# EAGLE design Ex 16 extra gpio 74HC595 (EAGLE 7.6.0)
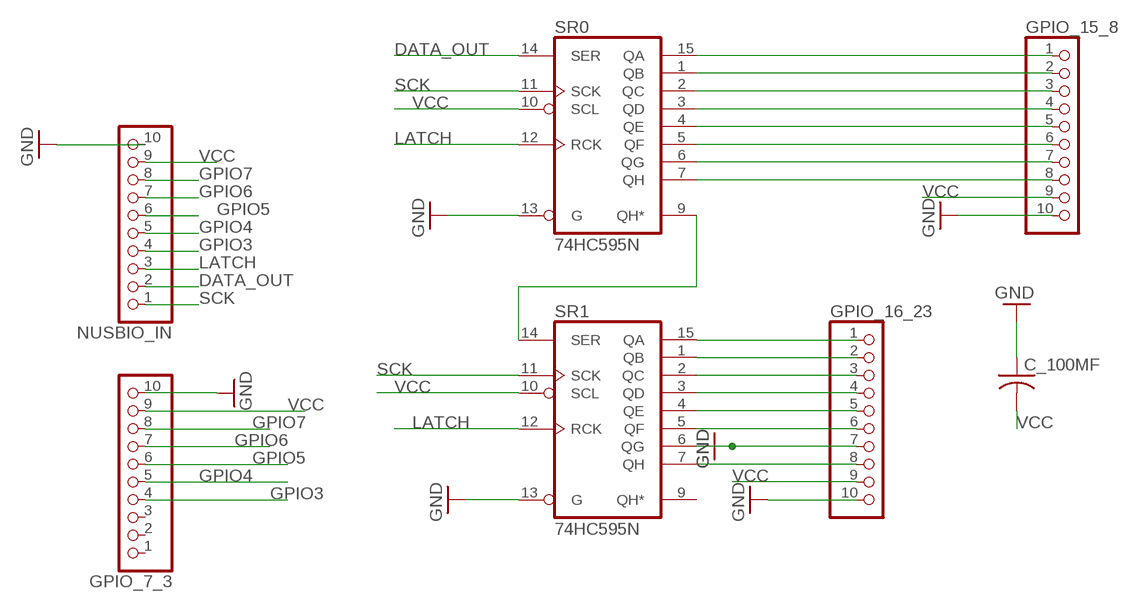
[diagram p0: schematic, sheet 1]

## Parts
C_100MF  C-US025-030X050  [C025-030X050]
GPIO_7_3  PINHD-1X10  [1X10-BIG]
GPIO_15_8  PINHD-1X10  [1X10-BIG]
GPIO_16_23  PINHD-1X10  [1X10-BIG]
NUSBIO_IN  PINHD-1X10  [1X10-BIG]
SR0  74HC595N  [DIL16]
SR1  74HC595N  [DIL16]

## Nets
DATA_OUT: NUSBIO_IN.2 SR0.14(SER)
GND: C_100MF.1 GPIO_7_3.10 GPIO_15_8.10 GPIO_16_23.10 NUSBIO_IN.10 SR0.13(G) SR1.13(G)
GPIO3: GPIO_7_3.4 NUSBIO_IN.4
GPIO4: GPIO_7_3.5 NUSBIO_IN.5
GPIO5: GPIO_7_3.6 NUSBIO_IN.6
GPIO6: GPIO_7_3.7 NUSBIO_IN.7
GPIO7: GPIO_7_3.8 NUSBIO_IN.8
LATCH: NUSBIO_IN.3 SR0.12(RCK) SR1.12(RCK)
N$1: GPIO_15_8.1 SR0.15(QA)
N$2: GPIO_15_8.2 SR0.1(QB)
N$3: GPIO_15_8.3 SR0.2(QC)
N$4: GPIO_15_8.4 SR0.3(QD)
N$5: GPIO_15_8.5 SR0.4(QE)
N$6: GPIO_15_8.6 SR0.5(QF)
N$7: GPIO_15_8.7 SR0.6(QG)
N$8: GPIO_15_8.8 SR0.7(QH)
N$9: SR0.9(QH*) SR1.14(SER)
N$10: GPIO_16_23.1 SR1.15(QA)
N$11: GPIO_16_23.2 SR1.1(QB)
N$12: GPIO_16_23.3 SR1.2(QC)
N$13: GPIO_16_23.4 SR1.3(QD)
N$14: GPIO_16_23.5 SR1.4(QE)
N$15: GPIO_16_23.6 SR1.5(QF)
N$16: GPIO_16_23.7 SR1.6(QG) ; supply symbol labelled GND
N$17: GPIO_16_23.8 SR1.7(QH)
SCK: NUSBIO_IN.1 SR0.11(SCK) SR1.11(SCK)
VCC: C_100MF.2 GPIO_7_3.9 GPIO_15_8.9 GPIO_16_23.9 NUSBIO_IN.9 SR0.10(SCL) SR1.10(SCL)
Unconnected: GPIO_7_3.1 GPIO_7_3.2 GPIO_7_3.3 SR1.9(QH*)

## Power pins joined to a net without a drawn wire
GND: SR0.8(GND) SR1.8(GND)
VCC: SR0.16(VCC) SR1.16(VCC)

## Library data of the parts
C_100MF = adafruit:C-US: CAPACITOR, American symbol
GPIO_7_3 GPIO_15_8 GPIO_16_23 NUSBIO_IN = adafruit:PINHD-1X10: Pin header 1x10 0.1" spacing With round pins
SR0 SR1 = 74xx-eu:74*595: 8-bit SHIFT REGISTER, output latch

## Board
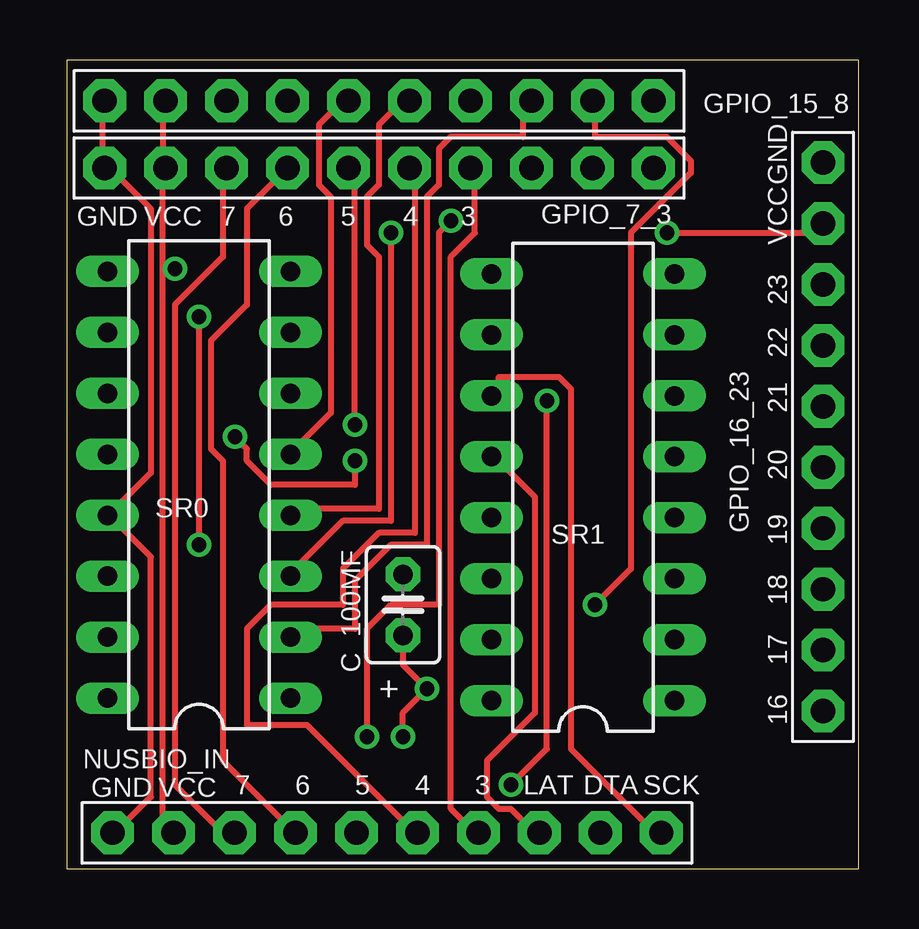
[diagram p1: board, top side]
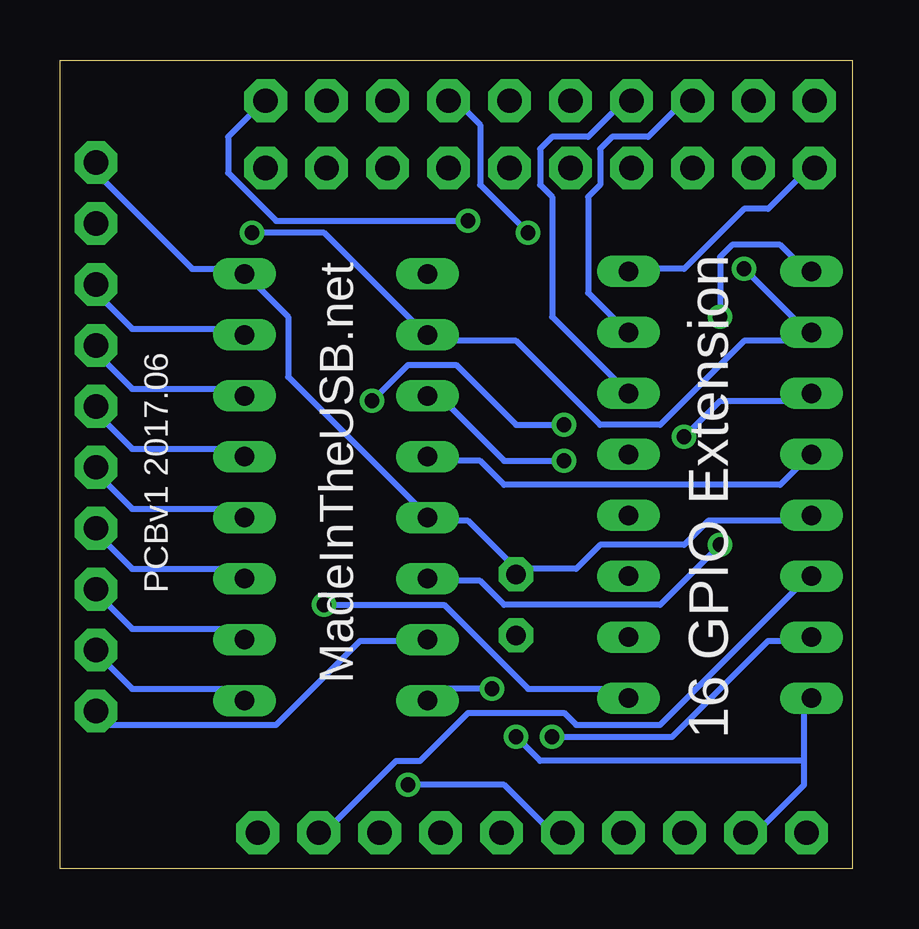
[diagram p2: board, bottom side, seen from below]

Size 33 x 33.7 mm. Coordinates in mm from the lower left corner, seen from the top.
Outline: 0,0 33,0 33,33.7 0,33.7 0,0
Copper layers (1*16): Top 0.035mm / dielectric 1.5mm / Bottom 0.035mm
Design rules "default": minimum track width 10mil, minimum drill 24mil, track to track 8mil, track to pad 8mil, pad to pad 8mil, via to via 8mil, smd to smd 8mil, copper to edge 40mil, drill to drill 8mil, minimum pad ring 10mil, minimum via ring 8mil, stop-mask expansion 4mil, vias tented up to drill 0mil, thermal gap 10mil

### Footprints (pad centres in the part's own frame; a part is rotated, then mirrored left to right if it is on the bottom)
C025-030X050 = drill 0.813 pad 1.422 octagon: 1 -1.27,0; 2 1.27,0
1X10-BIG = drill 1.016 pad 1.778 octagon: 1 -11.43,0; 2 -8.89,0; 3 -6.35,0; 4 -3.81,0; 5 -1.27,0; 6 1.27,0; 7 3.81,0; 8 6.35,0; 9 8.89,0; 10 11.43,0
DIL16 = drill 0.813 long: 1 -8.89,-3.81; 2 -6.35,-3.81; 3 -3.81,-3.81; 4 -1.27,-3.81; 5 1.27,-3.81; 6 3.81,-3.81; 7 6.35,-3.81; 8 8.89,-3.81; 9 8.89,3.81; 10 6.35,3.81; 11 3.81,3.81; 12 1.27,3.81; 13 -1.27,3.81; 14 -3.81,3.81; 15 -6.35,3.81; 16 -8.89,3.81

### Placement (x,y rotation side)
C_100MF  14,11 270 top
GPIO_7_3  13,29.2 180 top
GPIO_15_8  13,32 180 top
GPIO_16_23  31.5,18 90 top
NUSBIO_IN  13.33,1.5 180 top
SR0  5.5,16 90 top
SR1  21.5,15.9 90 top

### Tracks (layer width: path | path; a pad name or v marks a point on that pad's centre or on a via)
DATA_OUT
  Bottom 0.254: SR0.14 2,12 8,6 11.5,6 12,6.5 16,6.5 18,4.5 19,4.5 22,1.5 NUSBIO_IN.2
GND
  Top 0.254: NUSBIO_IN.10 2,1.5 3.5,3 3.5,13 2,14.5 SR0.13 2,15 3.5,16.5 3.5,27.5 2,29 GPIO_7_3.10 1.5,29.5 1.5,32 GPIO_15_8.10
  Bottom 0.254: 14,12.5 16,14.5 17.5,14.5 SR1.13 18,15 23.5,20.5 23.5,23 25,24.5 SR1.8 25.5,25 27.5,25 31.5,29 GPIO_16_23.10 | SR0.8 9,25 7,25 4.5,27.5 3.5,27.5 2,29 GPIO_7_3.10 | 14,12.5 11.5,12.5 10.5,13.5 7,13.5 6,14.5 2,14.5 SR0.13 | 14,12.5 C_100MF.1
GPIO3
  Top 0.254: GPIO_7_3.4 17,29 17,26.5 16,25.5 16,2.5 17,1.5 NUSBIO_IN.4
GPIO4
  Top 0.254: NUSBIO_IN.5 14.5,1.5 10,6 7.5,6 7.5,10 8.5,11 11.5,11 11.5,12.5 13,14 14.5,14 14.5,29 GPIO_7_3.5
GPIO5  (via drill 0.61)
  Top 0.254: v12,18.5 12,29 GPIO_7_3.6 | v20,19.5 20,5 v18.5,3.5
  Bottom 0.254: v12,18.5 14,18.5 16.5,21 18.5,21 v20,19.5 | v18.5,3.5 14.5,3.5 12.5,1.5 NUSBIO_IN.6
GPIO6
  Top 0.254: NUSBIO_IN.7 9.5,1.5 6.5,4.5 6.5,17 6,17.5 6,22 7.5,23.5 7.5,27.5 9,29 GPIO_7_3.7
GPIO7
  Top 0.254: NUSBIO_IN.8 6.5,1.5 4.5,3.5 4.5,23.5 6.5,25.5 6.5,29 GPIO_7_3.8
LATCH
  Top 0.254: NUSBIO_IN.3 19.5,1.5 18.5,2.5 18,2.5 17.5,3 17.5,4.5 19.5,6.5 19.5,15.5 18,17 SR1.12
  Bottom 0.254: SR1.12 17.5,17 15.5,17 14.5,16 3,16 2,17 SR0.12
N$1  (via drill 0.61)
  Top 0.254: v12.5,5.5 12.5,10 13.5,11 15.5,11 15.5,26.5 v16,27
  Bottom 0.254: v12.5,5.5 7.5,5.5 3.5,9.5 2,9.5 SR0.15 | v16,27 24,27 26,29 26,30.5 24.5,32 GPIO_15_8.1
N$2  (via drill 0.61)
  Top 0.254: v22,11 23.5,12.5 23.5,26.5 26,29 26,29.5 25,30.5 22,30.5 22,32 GPIO_15_8.2
  Bottom 0.254: v22,11 17,11 13.5,7.5 9.5,7.5 SR0.1
N$3
  Top 0.254: SR0.2 9.5,10 12,10 12,12 13.5,13.5 15,13.5 15,28 15.5,28.5 15.5,30 16,30.5 19,30.5 19,32 GPIO_15_8.3
N$4  (via drill 0.61)
  Top 0.254: v13.5,26.5 13.5,14.5 11.5,14.5 9.5,12.5 SR0.3
  Bottom 0.254: v13.5,26.5 15.5,28.5 15.5,31 16.5,32 GPIO_15_8.4
N$5
  Top 0.254: SR0.4 9.5,15 13,15 13,25.5 12.5,26 12.5,28 13,28.5 13,31 14,32 GPIO_15_8.5
N$6
  Top 0.254: SR0.5 9.5,17.5 11,19 11,28 10.5,28.5 10.5,31 11.5,32 GPIO_15_8.6
N$7
  Bottom 0.254: SR0.6 12.5,23 12.5,28 13,28.5 13,30 12.5,30.5 11,30.5 9.5,32 GPIO_15_8.7
N$8
  Bottom 0.254: SR0.7 9.5,22.5 11,24 11,28 10.5,28.5 10.5,30 10,30.5 8.5,30.5 7,32 GPIO_15_8.8
N$9  (via drill 0.61)
  Top 0.254: v5.5,23 v5.5,13.5
  Bottom 0.254: v5.5,13.5 8,11 14.5,11 15.5,12 17.5,12 SR1.14 | v5.5,23 5.5,25.5 5,26 3,26 2,25 SR0.9
N$10
  Bottom 0.254: SR1.15 18,9.5 20.5,9.5 24,6 31,6 31.5,6.5 GPIO_16_23.1
N$11
  Bottom 0.254: SR1.1 25.5,7.5 30,7.5 31.5,9 GPIO_16_23.2
N$12
  Bottom 0.254: SR1.2 25.5,10 30,10 31.5,11.5 GPIO_16_23.3
N$13
  Bottom 0.254: SR1.3 25.5,12.5 30,12.5 31.5,14 GPIO_16_23.4
N$14
  Bottom 0.254: SR1.4 25.5,15 30,15 31.5,16.5 GPIO_16_23.5
N$15
  Bottom 0.254: SR1.5 25.5,17.5 30,17.5 31.5,19 GPIO_16_23.6
N$16
  Bottom 0.254: SR1.6 25.5,20 30,20 31.5,21.5 GPIO_16_23.7
N$17
  Bottom 0.254: SR1.7 25.5,22.5 30,22.5 31.5,24 GPIO_16_23.8
SCK  (via drill 0.61)
  Top 0.254: v7,18 7.5,17.5 7.5,17 8.5,16 12,16 v12,17 | NUSBIO_IN.1 24.5,1.5 21,5 21,20 20.5,20.5 18,20.5 18,20 SR1.11
  Bottom 0.254: v7,18 5.5,19.5 2,19.5 SR0.11 | v12,17 14.5,17 17.5,20 SR1.11
VCC  (via drill 0.61)
  Top 0.254: v25,26.5 31.5,26.5 GPIO_16_23.9 | C_100MF.2 14,8.5 v15,7.5 14,6.5 v14,5.5 | GPIO_15_8.9 4,32 4,29.5 GPIO_7_3.9 4,29 4,25 | 4,25 4,1.5 NUSBIO_IN.9 | 4,25 v4.5,25
  Bottom 0.254: v25,26.5 22,26.5 18,22.5 SR1.10 17.5,22 14,22 10.5,18.5 8,18.5 4.5,22 2,22 SR0.10 2,22.5 v4.5,25 | v15,7.5 17.5,7.5 SR1.16 | 2,4.5 2,3.5 4,1.5 NUSBIO_IN.9 | 2,4.5 2,7 SR0.16 | v14,5.5 13,4.5 2,4.5

### Text on the board
tNames: GND | GND | VCC | 7 | 6 | 5 | 4 | 3 | VCC | 23 | 22 | 21 | 20 | 19 | 18 | 17 | + | 16 | GND | VCC | 7 | 6 | 5 | 4 | 3 | LAT | DTA | SCK
bNames: 16 GPIO Extension | MadeInTheUSB.net | PCBv1 2017.06